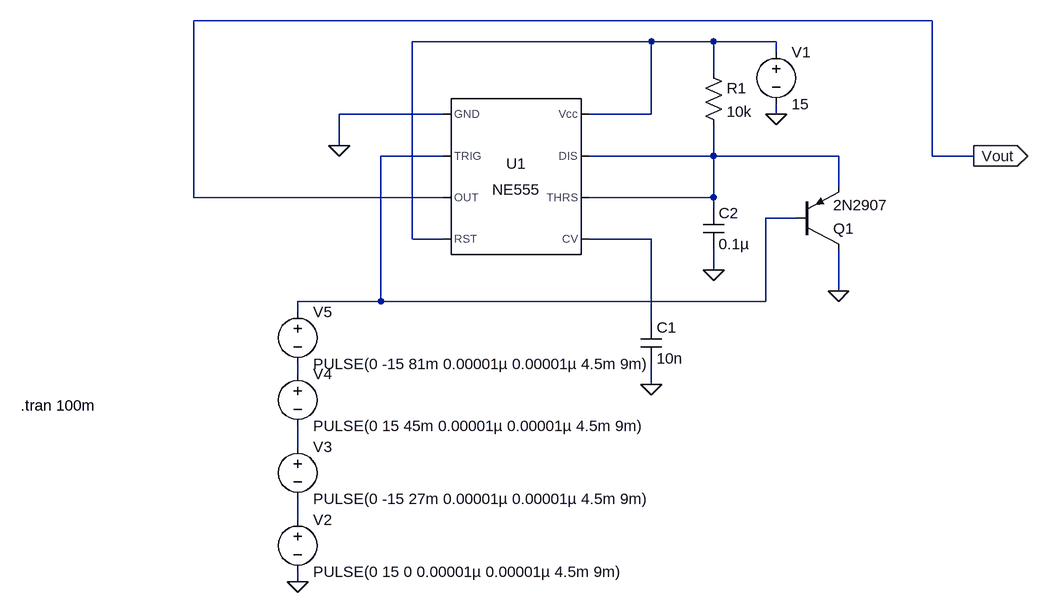
[diagram p0: schematic missing_pulse_detector.asc]
missing_pulse_detector.asc, the LTspice schematic file:
Version 4
SHEET 1 1008 868
WIRE 832 -80 -304 -80
WIRE 400 -48 32 -48
WIRE 496 -48 400 -48
WIRE 592 -48 496 -48
WIRE 592 -32 592 -48
WIRE 496 0 496 -48
WIRE 80 64 -80 64
WIRE 400 64 400 -48
WIRE 400 64 304 64
WIRE 592 64 592 48
WIRE -80 112 -80 64
WIRE 80 128 -16 128
WIRE 496 128 496 80
WIRE 496 128 304 128
WIRE 688 128 496 128
WIRE 832 128 832 -80
WIRE 896 128 832 128
WIRE 688 176 688 128
WIRE -304 192 -304 -80
WIRE 80 192 -304 192
WIRE 496 192 496 128
WIRE 496 192 304 192
WIRE 496 208 496 192
WIRE 624 224 576 224
WIRE 32 256 32 -48
WIRE 80 256 32 256
WIRE 400 256 304 256
WIRE 496 304 496 272
WIRE 688 336 688 272
WIRE -16 352 -16 128
WIRE -16 352 -144 352
WIRE 576 352 576 224
WIRE 576 352 -16 352
WIRE -144 368 -144 352
WIRE 400 384 400 256
WIRE -144 464 -144 448
WIRE 400 480 400 448
WIRE -144 576 -144 544
WIRE -144 688 -144 656
WIRE -144 784 -144 768
FLAG 592 64 0
FLAG 400 480 0
FLAG -80 112 0
FLAG 896 128 Vout
IOPIN 896 128 Out
FLAG 688 336 0
FLAG 496 304 0
FLAG -144 784 0
SYMBOL Misc\\NE555 192 160 R0
SYMATTR InstName U1
SYMBOL voltage 592 -48 R0
WINDOW 123 0 0 Left 0
WINDOW 39 0 0 Left 0
SYMATTR InstName V1
SYMATTR Value 15
SYMBOL pnp 624 272 M180
SYMATTR InstName Q1
SYMATTR Value 2N2907
SYMBOL cap 384 384 R0
SYMATTR InstName C1
SYMATTR Value 10n
SYMBOL cap 480 208 R0
SYMATTR InstName C2
SYMATTR Value 0.1µ
SYMBOL res 480 -16 R0
SYMATTR InstName R1
SYMATTR Value 10k
SYMBOL voltage -144 672 R0
WINDOW 123 0 0 Left 0
WINDOW 39 0 0 Left 0
SYMATTR InstName V2
SYMATTR Value PULSE(0 15 0 0.00001µ 0.00001µ 4.5m 9m)
SYMBOL voltage -144 560 R0
WINDOW 123 0 0 Left 0
WINDOW 39 0 0 Left 0
SYMATTR InstName V3
SYMATTR Value PULSE(0 -15 27m 0.00001µ 0.00001µ 4.5m 9m)
SYMBOL voltage -144 448 R0
WINDOW 123 0 0 Left 0
WINDOW 39 0 0 Left 0
SYMATTR InstName V4
SYMATTR Value PULSE(0 15 45m 0.00001µ 0.00001µ 4.5m 9m)
SYMBOL voltage -144 352 R0
WINDOW 123 0 0 Left 0
WINDOW 39 0 0 Left 0
SYMATTR InstName V5
SYMATTR Value PULSE(0 -15 81m 0.00001µ 0.00001µ 4.5m 9m)
TEXT -570 512 Left 2 !.tran 100m

The netlist it stands for:
* missing_pulse_detector.asc
XU1 0 N002 Vout N001 N004 N003 N003 N001 NE555  ; pins GND TRIG OUT RST CV THRS DIS Vcc
V1 N001 0 15
Q1 0 N002 N003 0 2N2907
C1 N004 0 10n
C2 N003 0 0.1µ
R1 N001 N003 10k
V2 N007 0 PULSE(0 15 0 0.00001µ 0.00001µ 4.5m 9m)
V3 N006 N007 PULSE(0 -15 27m 0.00001µ 0.00001µ 4.5m 9m)
V4 N005 N006 PULSE(0 15 45m 0.00001µ 0.00001µ 4.5m 9m)
V5 N002 N005 PULSE(0 -15 81m 0.00001µ 0.00001µ 4.5m 9m)
.model NPN NPN
.model PNP PNP
.lib standard.bjt
.tran 100m
.lib NE555.sub
.backanno
.end